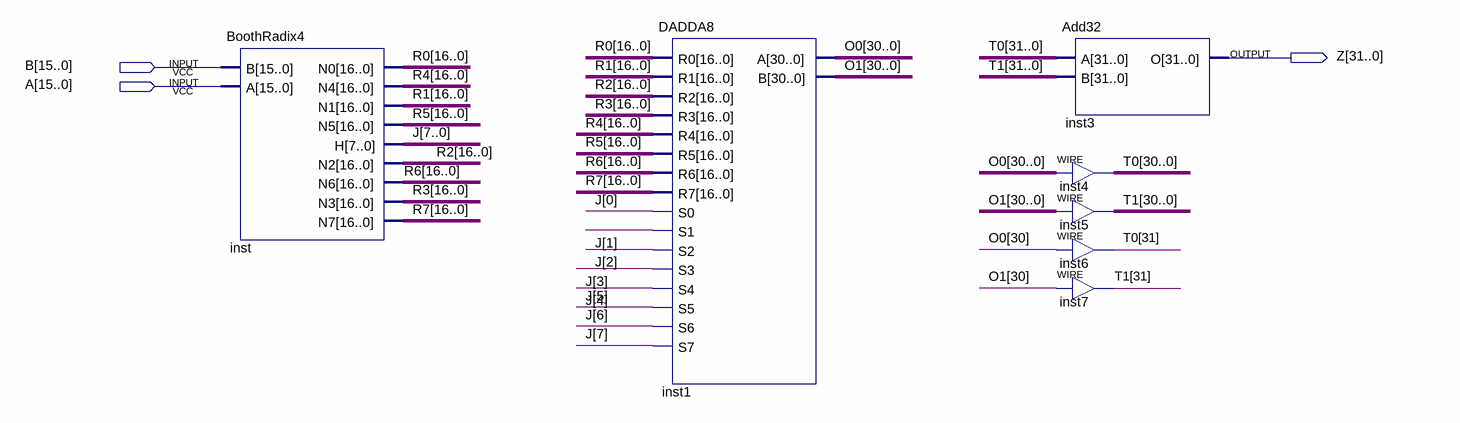
[diagram p0: schematic sheet]
// Quartus schematic mul16x16.bdf as structural Verilog: 7 symbols, 3 pins
module mul16x16 (
  input  [15:0] B,
  input  [15:0] A,
  output [31:0] Z
);

  wire [7:0] J;
  wire [16:0] R0, R1, R2, R3, R4, R5, R6, R7;
  wire [30:0] O0, O1;
  wire [31:0] T0, T1;

  BoothRadix4 inst (.B(B), .A(A), .N0(R0), .N4(R4), .N1(R1), .N5(R5), .H(J), .N2(R2), .N6(R6), .N3(R3), .N7(R7));
  DADDA8 inst1 (
    .R0(R0), .R1(R1), .R2(R2), .R3(R3), .R4(R4), .R5(R5), .R6(R6), .R7(R7), .S0(J[0]), .S1(J[1]), .S2(J[2]),
    .S3(J[3]), .S4(J[4]), .S5(J[5]), .S6(J[6]), .S7(J[7]), .A(O0), .B(O1));
  Add32 inst3 (.A(T0), .B(T1), .O(Z));
  assign T0[30:0] = O0;  // WIRE inst4
  assign T1[30:0] = O1;  // WIRE inst5
  assign T0[31] = O0[30];  // WIRE inst6
  assign T1[31] = O1[30];  // WIRE inst7
endmodule
